# Altium schematic sheet Sheet1.SchDoc
size A4; SheetNumber: 1; SheetTotal: 1
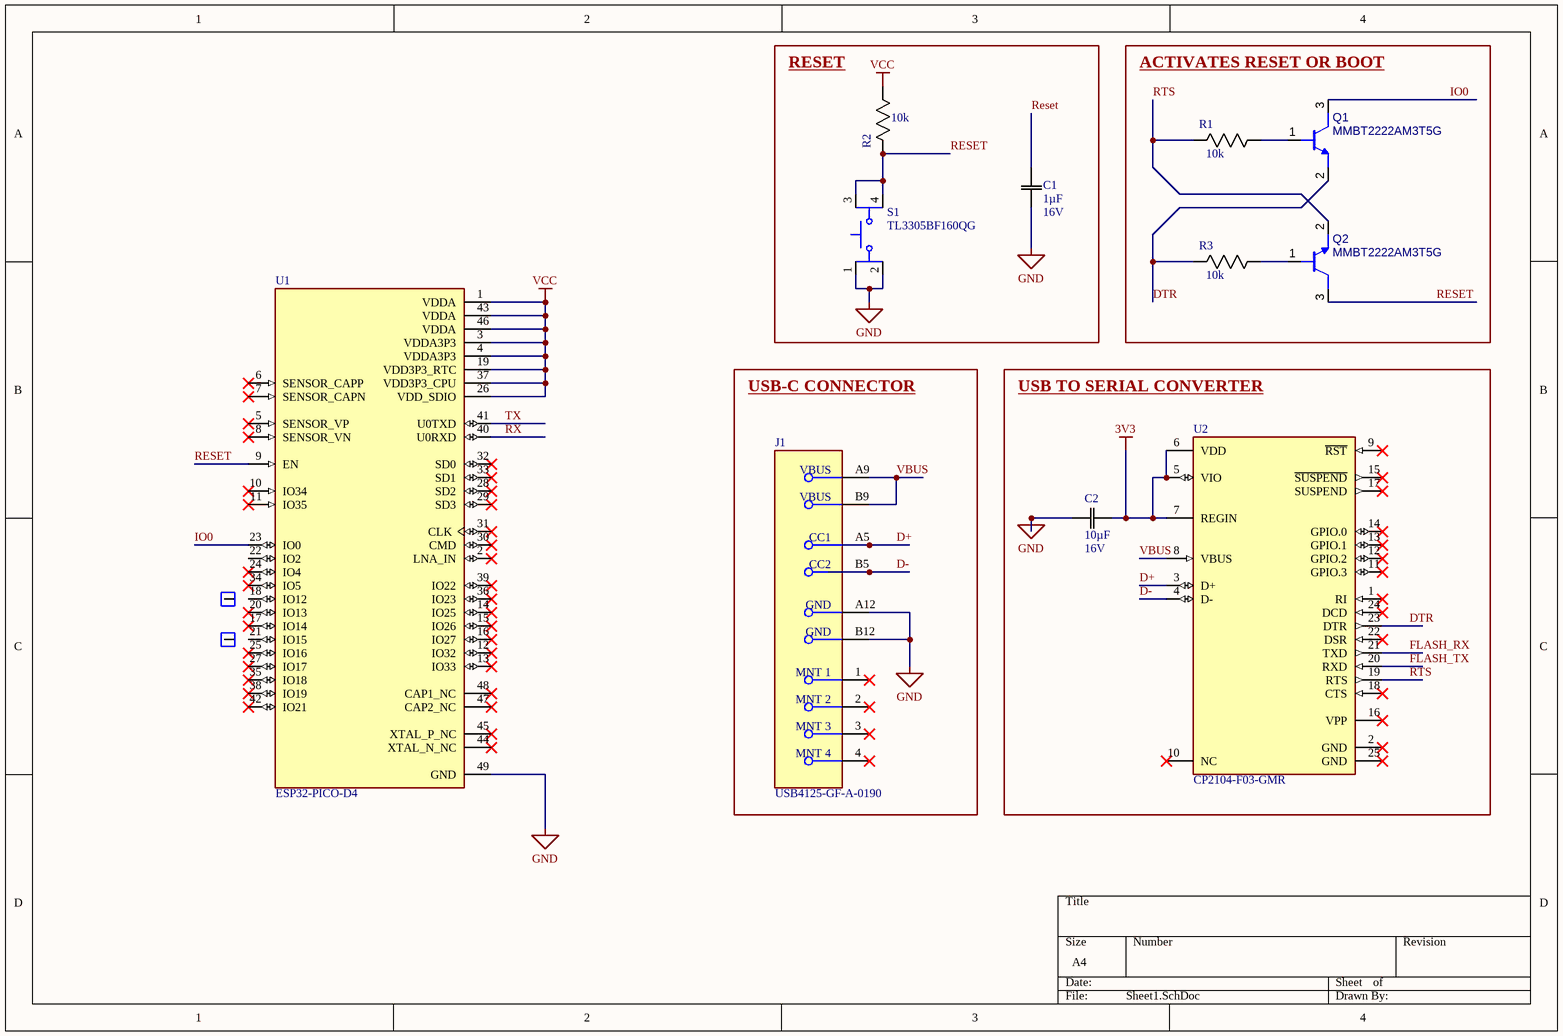
[diagram p0: Sheet1.SchDoc]

## Parts
1  Breakout Pin 0603  [BreakoutPin 0603]  (value not drawn)
2  Breakout Pin 0603  [BreakoutPin 0603]  (value not drawn)
C1  value 1µF  Rating: 16V  [0603]  (hidden comment: CAP 1.0uF 16V)
C2  value 10µF  Rating: 16V  [0603]  (hidden comment: CAP 10uF 16V)
J1  USB4125-GF-A-0190  [FP-USB4125-GF-A-0190-MFG]
Q1  MMBT2222AM3T5G  [ROHM-SOT723-3_V]
Q2  MMBT2222AM3T5G  [ROHM-SOT723-3_V]
R1  value 10k  [0603]  (hidden comment: RES 10k 1/8W - 1%)
R2  value 10k  [0603]  (hidden comment: RES 10k 1/8W - 1%)
R3  value 10k  [0603]  (hidden comment: RES 10k 1/8W - 1%)
S1  TL3305BF160QG  [SW_TL3305BF160QG]
U1  ESP32-PICO-D4  [PQFN50P700X700X104-49N - BigPads]
U2  CP2104-F03-GMR  [FP-CP2104-F03-GMR-MFG]

## Blocks framed on the sheet
RESET: C1 R2 S1
ACTIVATES RESET OR BOOT: Q1 Q2 R1 R3
USB-C CONNECTOR: J1
USB TO SERIAL CONVERTER: C2 U2

## Nets
3V3: C2.1(C1) U2.5(VIO) U2.6(VDD) U2.7(REGIN)
GND: C1.1(C1) C2.2(C2) J1.A12(GND) J1.B12(GND) S1.1 S1.2 U1.49(GND)
VCC: R2.1(R1) U1.1(VDDA) U1.3(VDDA3P3) U1.4(VDDA3P3) U1.19(VDD3P3_RTC) U1.26(VDD_SDIO) U1.37(VDD3P3_CPU) U1.43(VDDA) U1.46(VDDA)
D+: J1.A5(CC1) U2.3(D+)
D-: J1.B5(CC2) U2.4(D-)
DTR: Q1.2(E) R3.2(R2) U2.23(DTR)
FLASH_RX: U2.21(TXD)
FLASH_TX: U2.20(RXD)
IO0: Q1.3(C) U1.23(IO0)
RESET: C1.2(C2) Q2.3(C) R2.2(R2) S1.3 S1.4 U1.9(EN)
RTS: Q2.2(E) R1.2(R2) U2.19(RTS)
RX: U1.40(U0RXD)
TX: U1.41(U0TXD)
VBUS: J1.A9(VBUS) J1.B9(VBUS) U2.8(VBUS)
NetQ1_1: Q1.1(B) R1.1(R1)
NetQ2_1: Q2.1(B) R3.1(R1)

Not connected (* = marked no-connect by the designer): 1 1(BRKOUT); 2 1(BRKOUT); J1 1(MNT_1)* 2(MNT_2)* 3(MNT_3)* 4(MNT_4)*; U1 2(LNA_IN)* 5(SENSOR_VP)* 6(SENSOR_CAPP)* 7(SENSOR_CAPN)* 8(SENSOR_VN)* 10(IO34)* 11(IO35)* 12(IO32)* 13(IO33)* 14(IO25)* 15(IO26)* 16(IO27)* 17(IO14)* 18(IO12) 20(IO13)* 21(IO15) 22(IO2) 24(IO4)* 25(IO16)* 27(IO17)* 28(SD2)* 29(SD3)* 30(CMD)* 31(CLK)* 32(SD0)* 33(SD1)* 34(IO5)* 35(IO18)* 36(IO23)* 38(IO19)* 39(IO22)* 42(IO21)* 44(XTAL_N_NC)* 45(XTAL_P_NC)* 47(CAP2_NC)* 48(CAP1_NC)*; U2 1(RI)* 2(GND)* 9(~{RST})* 10(NC)* 11(GPIO.3)* 12(GPIO.2)* 13(GPIO.1)* 14(GPIO.0)* 15(~{SUSPEND})* 16(VPP)* 17(SUSPEND)* 18(CTS)* 22(DSR)* 24(DCD)* 25(GND)*

## Library data of the parts
1 2 = Breakout Pin 0603: 0603 breakout pad; Part Number: Breakout Pin 0603
C1 = CMP-001-00114-1: Temperature Coefficient: X5R; Tolerance: 10%; Part Number: CAP 1.0uF 16V
C2 = CMP-001-00126-1: Tolerance: 10%; Temperature Coefficient: X5R; Part Number: CAP 10uF 16V
J1 = CMP-245163-000004-1: CONN RCPT TYPE C 6P SMD RA
Q1 Q2 = CMP-013-00028-2: NPN General Purpose Transistor, 3-Pin SOT-723, Pb-Free, Tape and Reel; ComponentLink3Description: Package Specification; ComponentLink1URL: http://www.onsemi.com/; ComponentLink3URL: http://www.onsemi.com/pub_link/Collateral/631AA.PDF; ComponentLink2Description: Datasheet; Mounting Technology: SMT; Pins: 3; Case/Package: SOT-723; RoHS Compliant: TRUE; ComponentLink1Description: Manufacturer URL; ComponentLink2URL: http://www.onsemi.cn/pub_link/Collateral/MMBT2222AM3-D.PDF
R1-R3 = CMP-009-00203-1: Manufacturer Part Number 1: ERJ-H3GJ103V; Tolerance: 5%; Tolerance 2: 5%; Supplier URL 2: https://www.digikey.ca/en/products/detail/stackpole-electronics-inc/RMCF0805JT10K0/1757762?s=N4IgTCBcDaIEoFkDCAxADADjQVgFIBUBGNAaTSXxAF0BfIA; Supplier URL 1: https://www.digikey.ca/en/products/detail/panasonic-electronic-components/ERJ-H3GJ103V/13877876?s=N4IgTCBcDaIIwAYC0BRASgKSQCQMwHENFcA1AYQBUkA5AERAF0BfIA; Part Number: RES 10k 1/8W - 1%; Manufacturer Part Number 2: RMCF0805JT10K0
S1 = Push button-1: Tactile Switch SPST-NO Top Actuated Surface Mount; MF: E-Switch; Purchase-URL: https://pricing.snapeda.com/search/part/TL3305BF160QG/?ref=eda; MP: TL3305BF160QG; Price: None; Component Type: Standard; Case/Package: None; Pins: 4; Availability: In Stock; Design Item ID: TL3305BF160QG; Value: *; Check_prices: https://www.snapeda.com/parts/TL3305BF160QG/E-Switch/view-part/?ref=eda; SnapEDA_Link: https://www.snapeda.com/parts/TL3305BF160QG/E-Switch/view-part/?ref=snap; Source: TL3305BF160QG.SchLib
U1 = CMP-026-000027-1: RX TXRX MOD WIFI SURFACE MOUNT; Supplier URL 1: https://www.digikey.com/en/products/detail/espressif-systems/ESP32-PICO-D4/9381722; Manufacturer Part Number 1: ESP32-PICO-D4; Part Number: ESP32-PICO-D4
U2 = CMP-08107-000004-1: IC SGL USB-TO-UART BRIDGE 24QFN; Manufacturer: Silicon Laboratories; Max Supply Voltage: 3.6V; Min Supply Voltage: 1.8V; Nominal Supply Current: 100-17000uA; Standoff Height: 0mm; Interface: UART,USB; Temperature Range Low: -40°C; Lead Free: Yes; Device Class L3: Controllers; Ambient Temperature Range Low: -55°C; Automotive: No; Category: IC; Temperature: -40°C to +85°C; Octopart: https://octopart.com/cp2104-f03-gmr-silicon+labs-19668642; Ambient Temperature Range High: +125°C; Package: CP2104-F03-GMR; Device Class L2: Interface ICs; Digikey Description: IC SGL USB-TO-UART BRIDGE 24QFN; Device Class L1: Integrated Circuits (ICs); Manufacturer Part Number: CP2104-F03-GMR; Temperature Range High: +85°C; ComponentLink2URL: https://www.silabs.com/documents/public/data-sheets/cp2104.pdf; Height: 0.8mm; Ipc Land Pattern Name: QFN50P400X400X75-24; Mouser Description: I/O Controller Interface IC USB to UART bridge; ComponentLink2Description: Datasheet; RoHS: TRUE